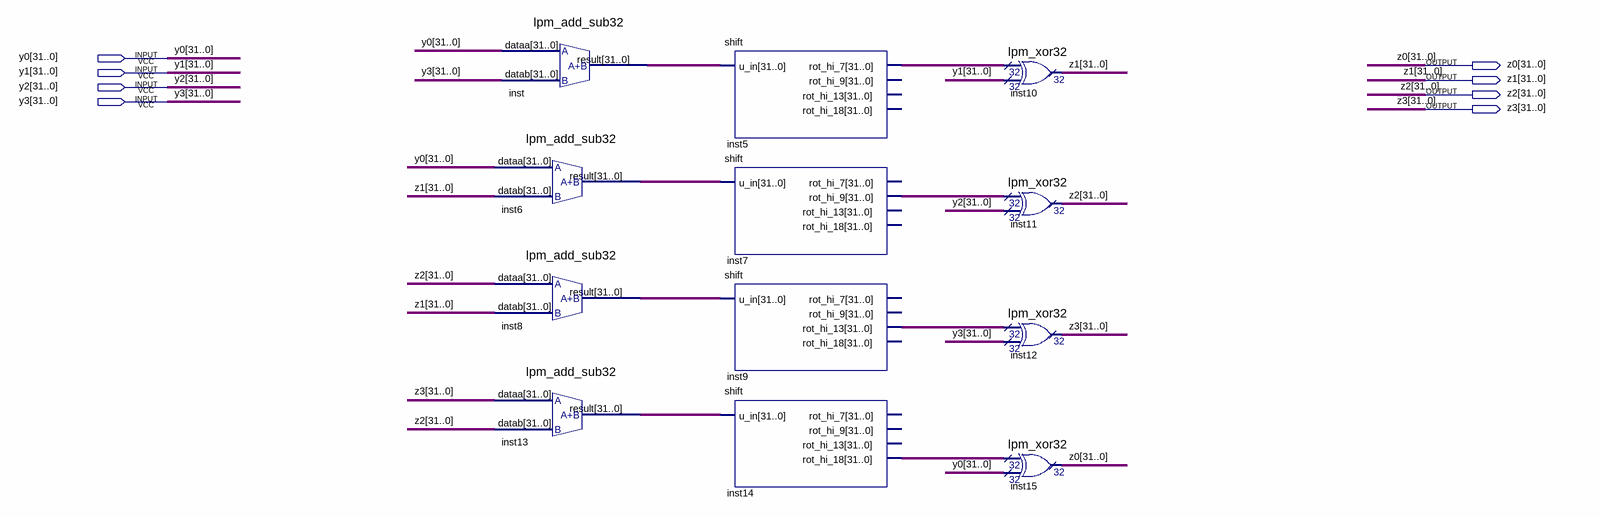
[diagram p0: schematic sheet]
// Quartus schematic quarterround.bdf as structural Verilog: 12 symbols, 8 pins
module quarterround (
  input  [31:0] y0,
  input  [31:0] y1,
  input  [31:0] y2,
  input  [31:0] y3,
  output [31:0] z0,
  output [31:0] z1,
  output [31:0] z2,
  output [31:0] z3
);

  wire [31:0] inst5_rot_hi_7, inst6_result, inst7_rot_hi_9, inst8_result, inst9_rot_hi_13, inst13_result,
       inst14_rot_hi_18, inst_result;

  lpm_add_sub32 inst (.dataa(y0), .datab(y3), .result(inst_result));
  lpm_add_sub32 inst6 (.dataa(y0), .datab(z1), .result(inst6_result));
  lpm_add_sub32 inst8 (.dataa(z2), .datab(z1), .result(inst8_result));
  lpm_add_sub32 inst13 (.dataa(z3), .datab(z2), .result(inst13_result));
  shift inst5 (.u_in(inst_result), .rot_hi_7(inst5_rot_hi_7));  // open: rot_hi_9, rot_hi_13, rot_hi_18
  shift inst7 (.u_in(inst6_result), .rot_hi_9(inst7_rot_hi_9));  // open: rot_hi_7, rot_hi_13, rot_hi_18
  shift inst9 (.u_in(inst8_result), .rot_hi_13(inst9_rot_hi_13));  // open: rot_hi_7, rot_hi_9, rot_hi_18
  shift inst14 (.u_in(inst13_result), .rot_hi_18(inst14_rot_hi_18));  // open: rot_hi_7, rot_hi_9, rot_hi_13
  lpm_xor32 inst10 (.data0x(inst5_rot_hi_7), .data1x(y1), .result(z1));
  lpm_xor32 inst11 (.data0x(inst7_rot_hi_9), .data1x(y2), .result(z2));
  lpm_xor32 inst12 (.data0x(inst9_rot_hi_13), .data1x(y3), .result(z3));
  lpm_xor32 inst15 (.data0x(inst14_rot_hi_18), .data1x(y0), .result(z0));
endmodule
